# EAGLE design micromouse (EAGLE 9.0.1)
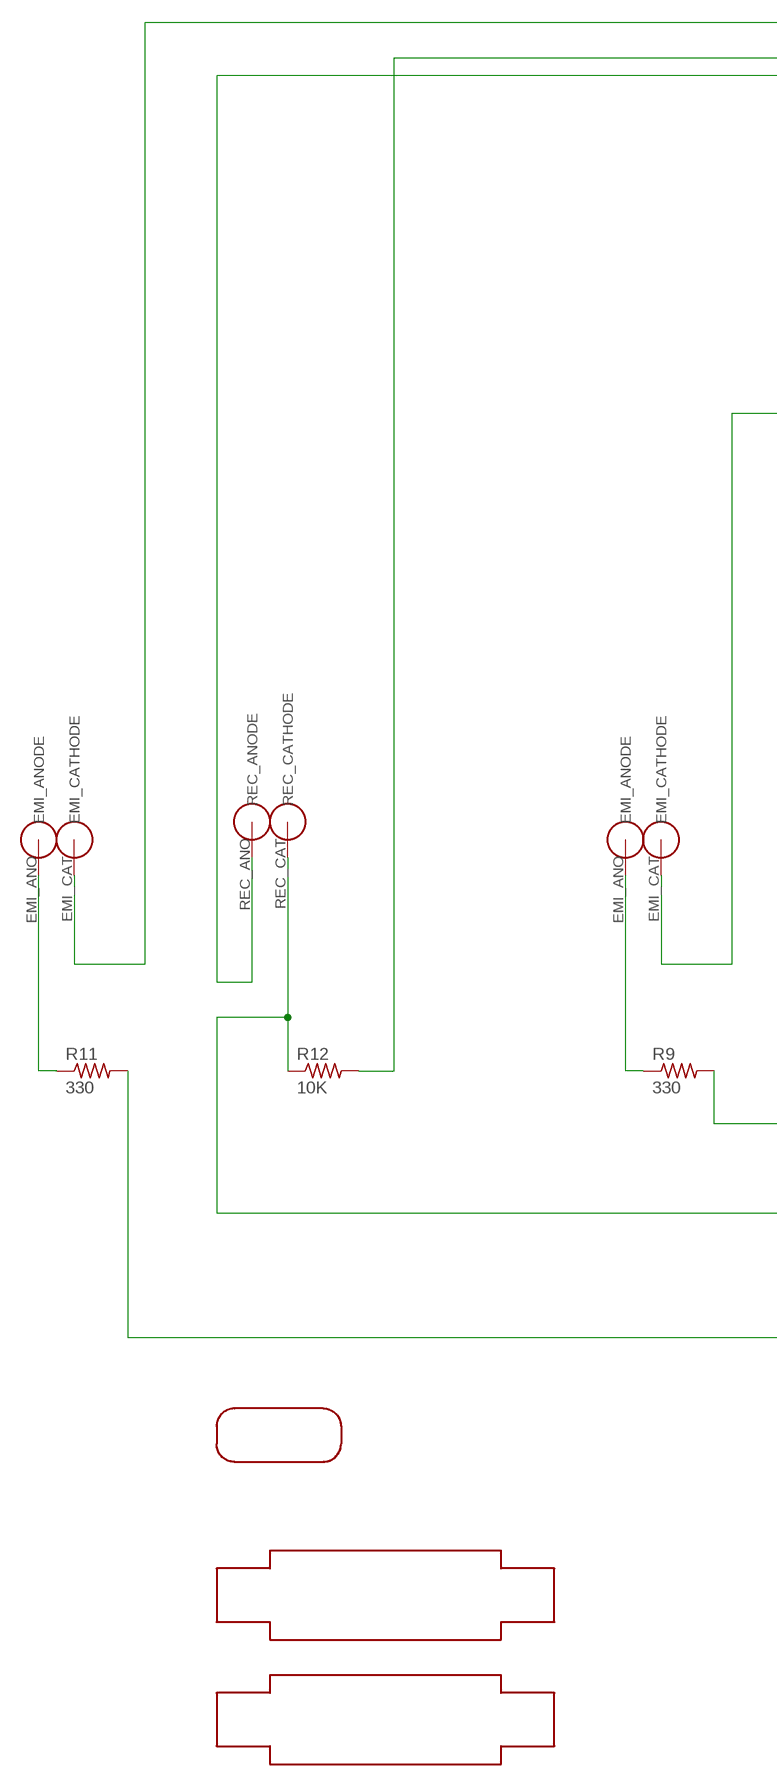
[diagram p0: schematic, sheet 1, part 1 of 2]
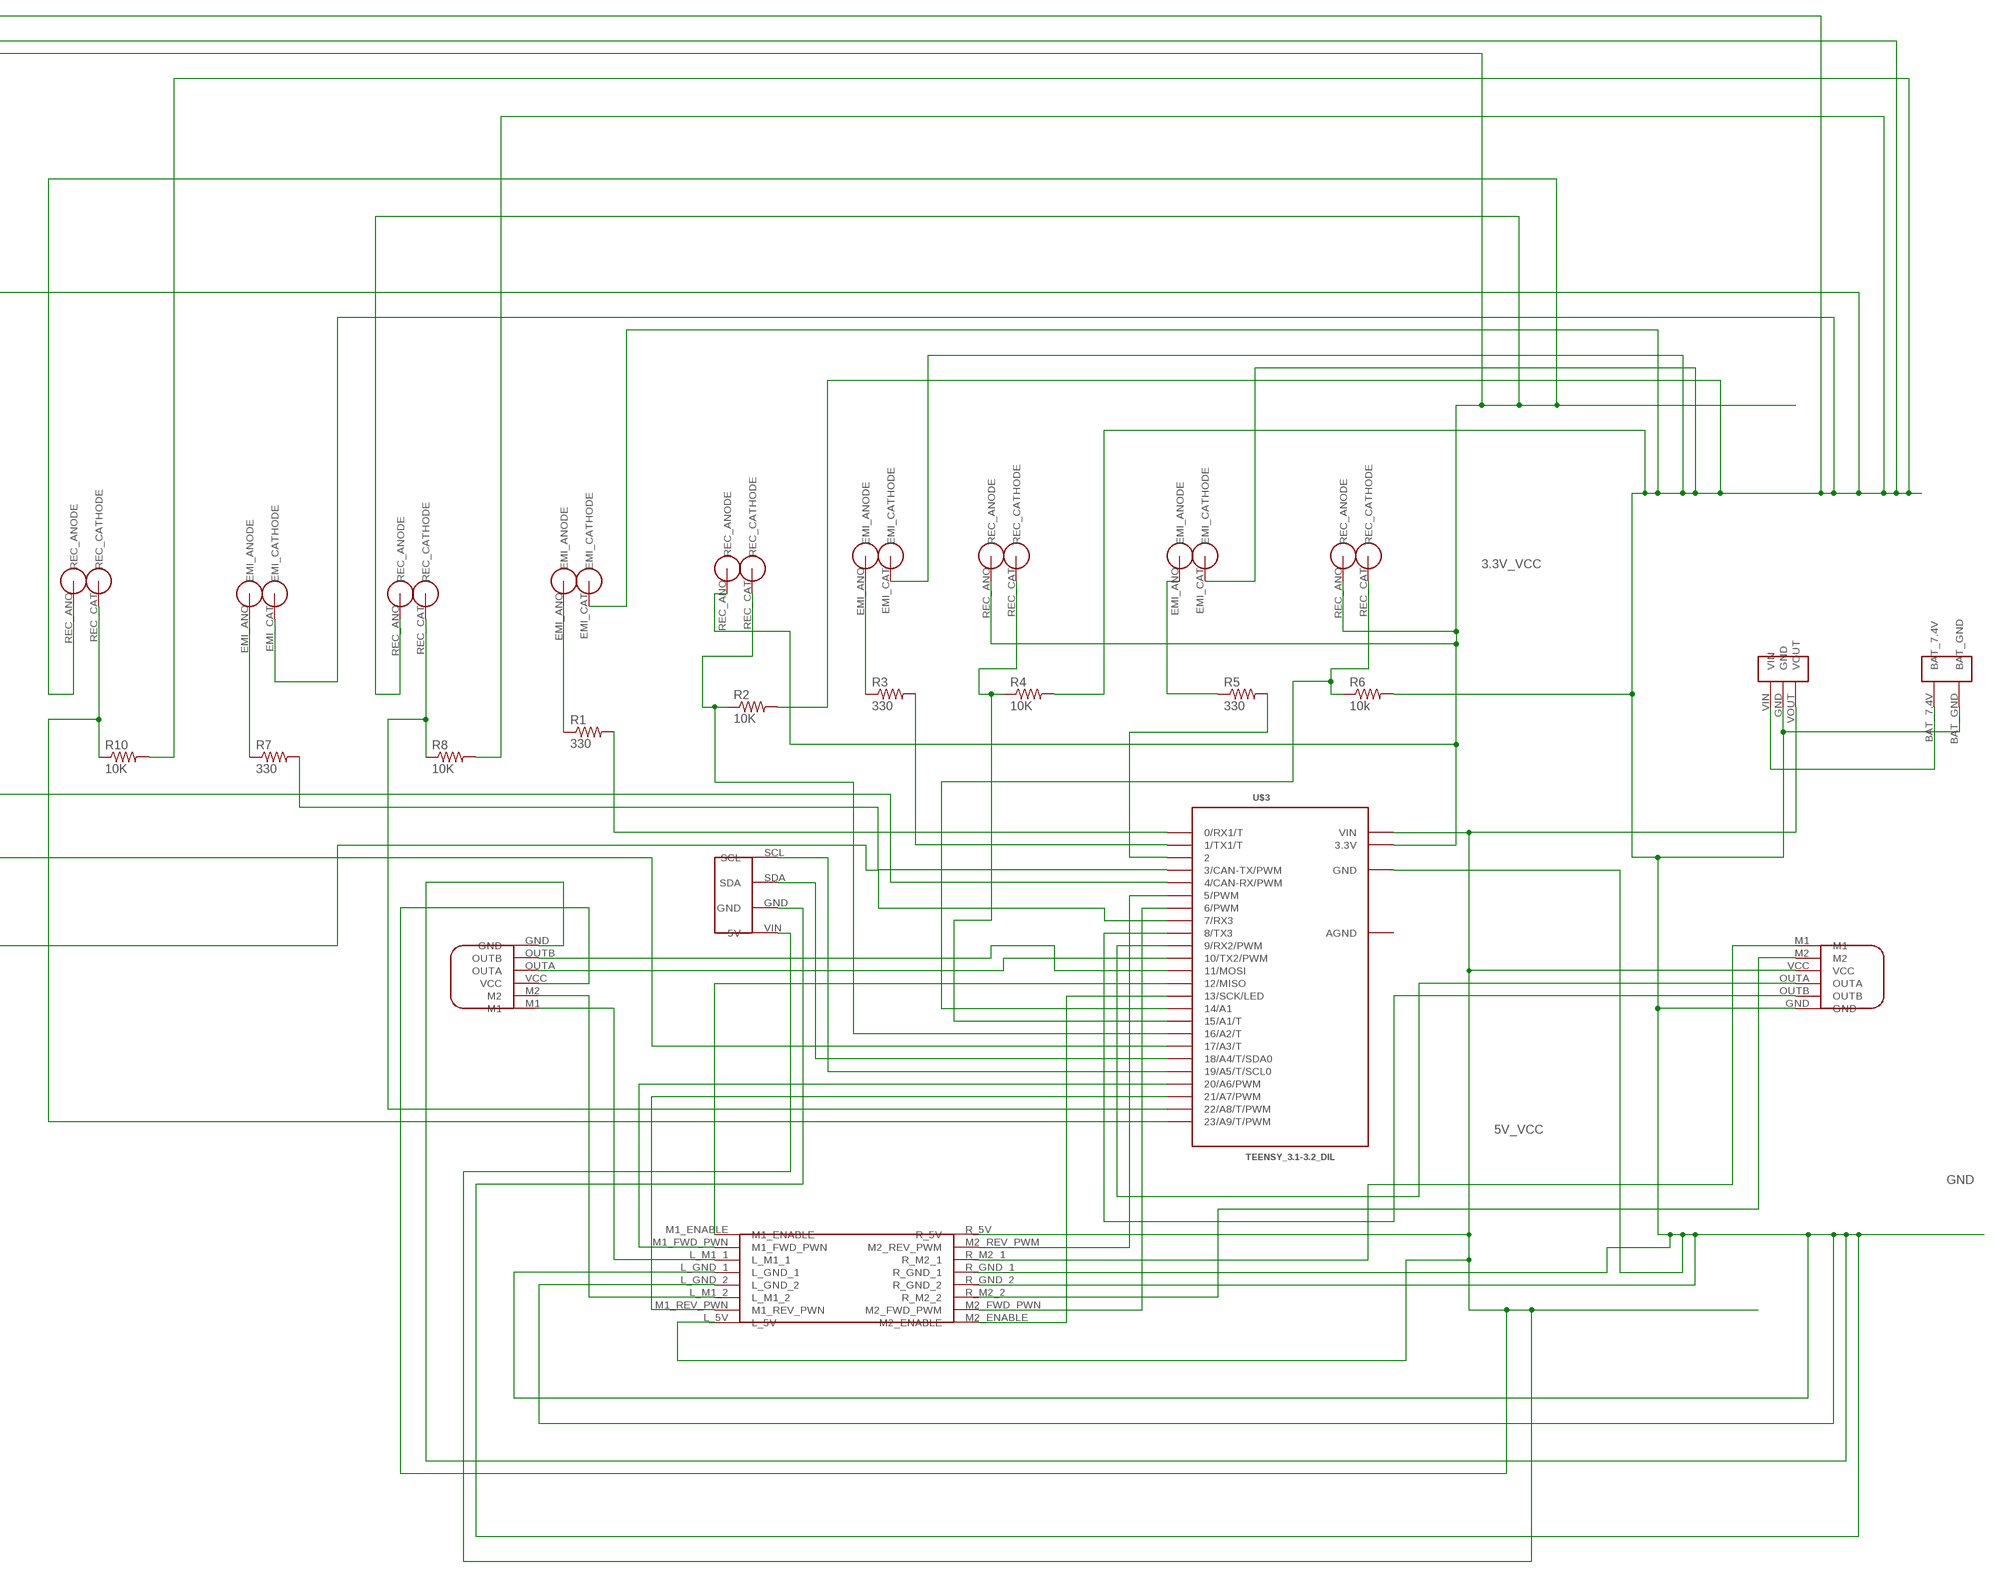
[diagram p1: schematic, sheet 1, part 2 of 2]

## Parts
R1  330  R-US_0207/10  [0207/10]
R2  10K  R-US_0207/10  [0207/10]
R3  330  R-US_0207/10  [0207/10]
R4  10K  R-US_0207/10  [0207/10]
R5  330  R-US_0207/10  [0207/10]
R6  10k  R-US_0207/10  [0207/10]
R7  330  R-US_0207/10  [0207/10]
R8  10K  R-US_0207/10  [0207/10]
R9  330  R-US_0207/10  [0207/10]
R10  10K  R-US_0207/10  [0207/10]
R11  330  R-US_0207/10  [0207/10]
R12  10K  R-US_0207/10  [0207/10]
U$1  MOTOR_ENCODER  [MOTOR_ENCODER]
U$2  MOTOR_ENCODER  [MOTOR_ENCODER]
U$3  TEENSY_3.1-3.2_DIL  [TEENSY_3.0-3.2&LC_DIL]
U$4  MOTOR_DRIVER  [MOTOR_DRIVER]
U$5  IR_RECIEVER  [IR_RECIEVER]
U$6  IR_EMITTER  [IR_EMITTER]
U$7  IR_EMITTER  [IR_EMITTER]
U$8  IR_RECIEVER  [IR_RECIEVER]
U$9  IR_EMITTER  [IR_EMITTER]
U$10  VOLTAGE_REGULATOR  [VOLTAGE_REGULATOR]
U$11  BATTERY_INPUT  [BATTERY_INPUT]
U$12  IR_RECIEVER  [IR_RECIEVER]
U$13  IMU  [IMU]
U$14  IR_EMITTER  [IR_EMITTER]
U$15  IR_RECIEVER  [IR_RECIEVER]
U$16  IR_EMITTER  [IR_EMITTER]
U$17  IR_RECIEVER  [IR_RECIEVER]
U$18  MOTOR_BRACKET  [MOTOR_BRACKET]
U$19  MOTOR_BRACKET  [MOTOR_BRACKET]
U$20  BALL_CASTER  [BALL_CASTER]
U$22  IR_EMITTER  [IR_EMITTER]
U$23  IR_RECIEVER  [IR_RECIEVER]

## Nets
3.3V_VCC: U$3.3.3V U$5.REC_ANO(REC_ANODE) U$8.REC_ANO(REC_ANODE) U$12.REC_ANO(REC_ANODE) U$15.REC_ANO(REC_ANODE) U$17.REC_ANO(REC_ANODE) U$23.REC_ANO(REC_ANODE)
5V_VCC: U$1.VCC U$2.VCC U$3.VIN U$4.L_5V U$4.R_5V U$10.VOUT U$13.VIN(5V)
GND: R2.2 R4.2 R6.2 R8.2 R10.2 R12.2 U$1.GND U$2.GND U$3.GND U$4.L_GND_1 U$4.L_GND_2 U$4.R_GND_1 U$4.R_GND_2 U$6.EMI_CAT(EMI_CATHODE) U$7.EMI_CAT(EMI_CATHODE) U$9.EMI_CAT(EMI_CATHODE) U$10.GND U$11.BAT_GND U$13.GND U$14.EMI_CAT(EMI_CATHODE) U$16.EMI_CAT(EMI_CATHODE) U$22.EMI_CAT(EMI_CATHODE)
M1_FWD_PWM: U$3.20/A6(20/A6/PWM) U$4.M1_FWD_PWN
M1_L: U$1.M1 U$4.L_M1_1
M1_R: U$2.M1 U$4.R_M2_1
M1_REV_PWM: U$3.21/A7(21/A7/PWM) U$4.M1_REV_PWN
M2_ENABLE: U$3.13(13/SCK/LED) U$4.M2_ENABLE
M2_FWD_PWM: U$3.6(6/PWM) U$4.M2_FWD_PWN(M2_FWD_PWM)
M2_L: U$1.M2 U$4.L_M1_2
M2_R: U$2.M2 U$4.R_M2_2
N$1: U$10.VIN U$11.BAT_7.4V
N$2: U$3.19/A5(19/A5/T/SCL0) U$13.SCL
N$3: U$3.18/A4(18/A4/T/SDA0) U$13.SDA
N$4: U$3.12(12/MISO) U$4.M1_ENABLE
N$5: U$3.5(5/PWM) U$4.M2_REV_PWM
N$6: R7.2 U$3.3(3/CAN-TX/PWM)
N$7: R7.1 U$14.EMI_ANO(EMI_ANODE)
N$8: R8.1 U$3.22/A8(22/A8/T/PWM) U$15.REC_CAT(REC_CATHODE)
N$9: R9.2 U$3.4(4/CAN-RX/PWM)
N$10: R9.1 U$16.EMI_ANO(EMI_ANODE)
N$11: R11.2 U$3.7(7/RX3)
N$12: R10.1 U$3.23/A9(23/A9/T/PWM) U$17.REC_CAT(REC_CATHODE)
N$13: R11.1 U$22.EMI_ANO(EMI_ANODE)
N$14: R12.1 U$3.17/A3(17/A3/T) U$23.REC_CAT(REC_CATHODE)
N$19: R1.2 U$3.0(0/RX1/T)
N$20: R1.1 U$9.EMI_ANO(EMI_ANODE)
N$21: R6.1 U$3.14/A0(14/A1) U$8.REC_CAT(REC_CATHODE)
N$22: R3.2 U$3.1(1/TX1/T)
N$23: R3.1 U$6.EMI_ANO(EMI_ANODE)
N$24: R4.1 U$3.15/A1(15/A1/T) U$12.REC_CAT(REC_CATHODE)
N$25: R5.2 U$3.2
N$26: R5.1 U$7.EMI_ANO(EMI_ANODE)
N$28: R2.1 U$3.16/A2(16/A2/T) U$5.REC_CAT(REC_CATHODE)
OUTA_L: U$1.OUTA U$3.10(10/TX2/PWM)
OUTA_R: U$2.OUTA U$3.9(9/RX2/PWM)
OUTB_L: U$1.OUTB U$3.11(11/MOSI)
OUTB_R: U$2.OUTB U$3.8(8/TX3)

## Power pins joined to a net without a drawn wire
AGND: U$3.AGND

## Library data of the parts
R1-R12 = rcl:R-US_: RESISTOR, American symbol; SPICEPREFIX: R
U$1 U$2 = MOTOR_ENCODER:MOTOR_ENCODER
U$3 = Teensy_3_and_LC_Series_Boards_v1.4:TEENSY_3.1-3.2_DIL: Teensy 3.1 or 3.2 in a DIL Layout.
U$4 = motor_driver:MOTOR_DRIVER
U$5 U$8 U$12 U$15 U$17 U$23 = IR_RECIEVER:IR_RECIEVER
U$6 U$7 U$9 U$14 U$16 U$22 = IR_EMITTER:IR_EMITTER
U$10 = VOLTAGE_REGULATOR:VOLTAGE_REGULATOR
U$11 = Battery_input:BATTERY_INPUT
U$13 = IMU:IMU
U$18 U$19 = MOTOR_BRACKET:MOTOR_BRACKET
U$20 = BALL_CASTER:BALL_CASTER

## Board
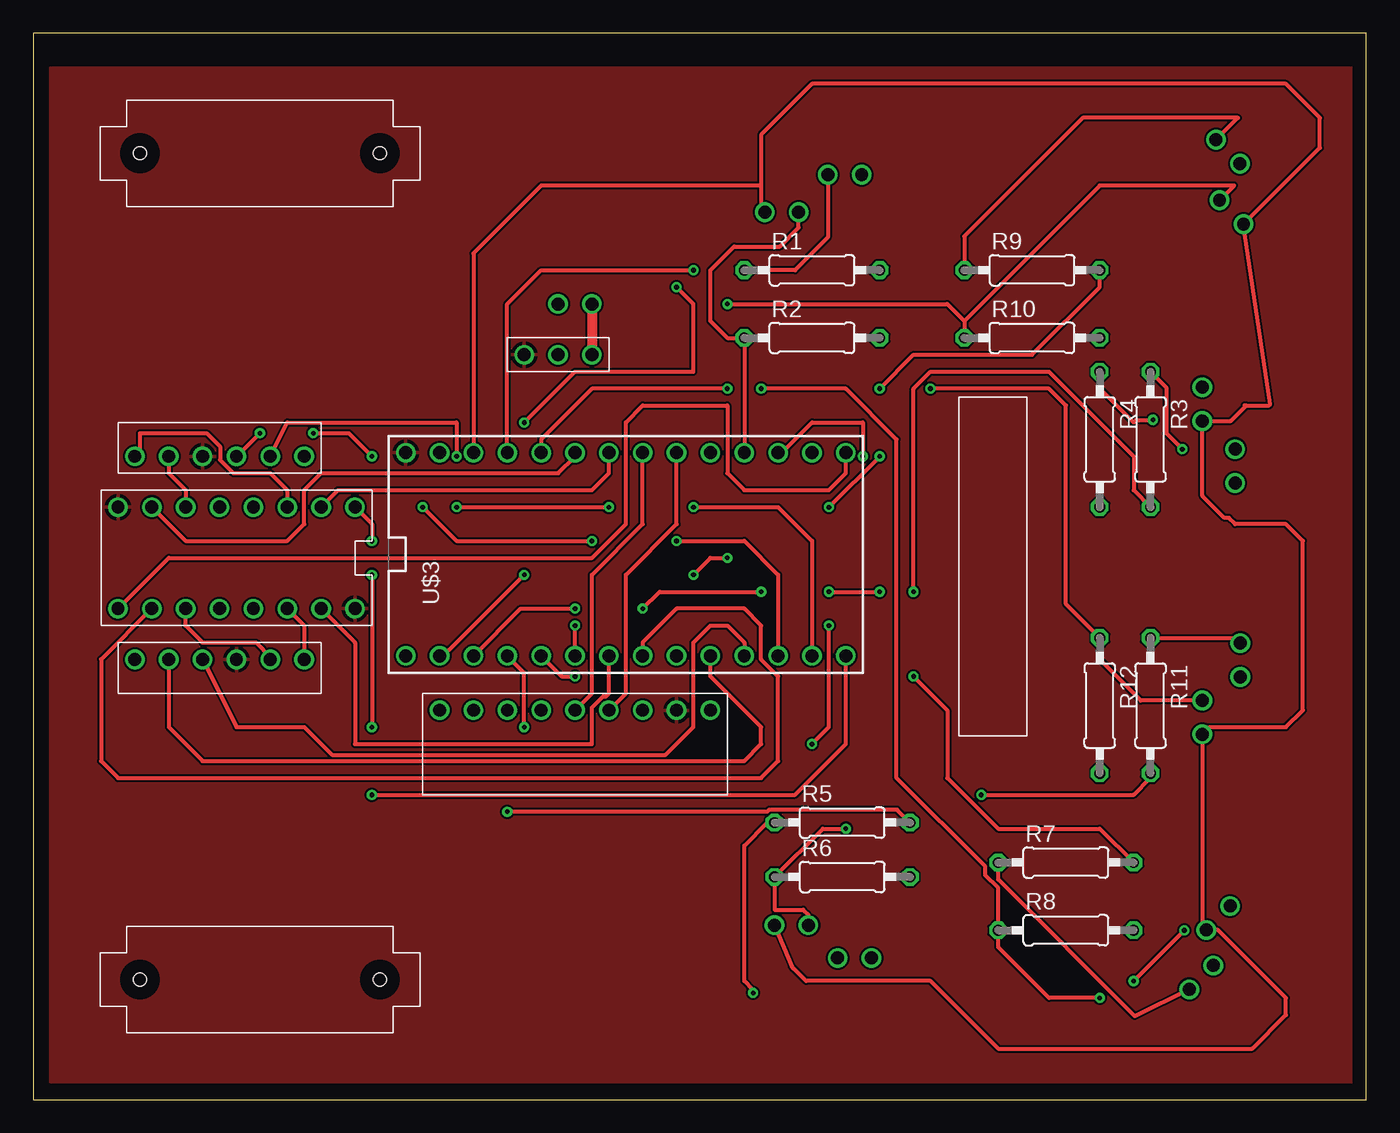
[diagram p2: board, top side]
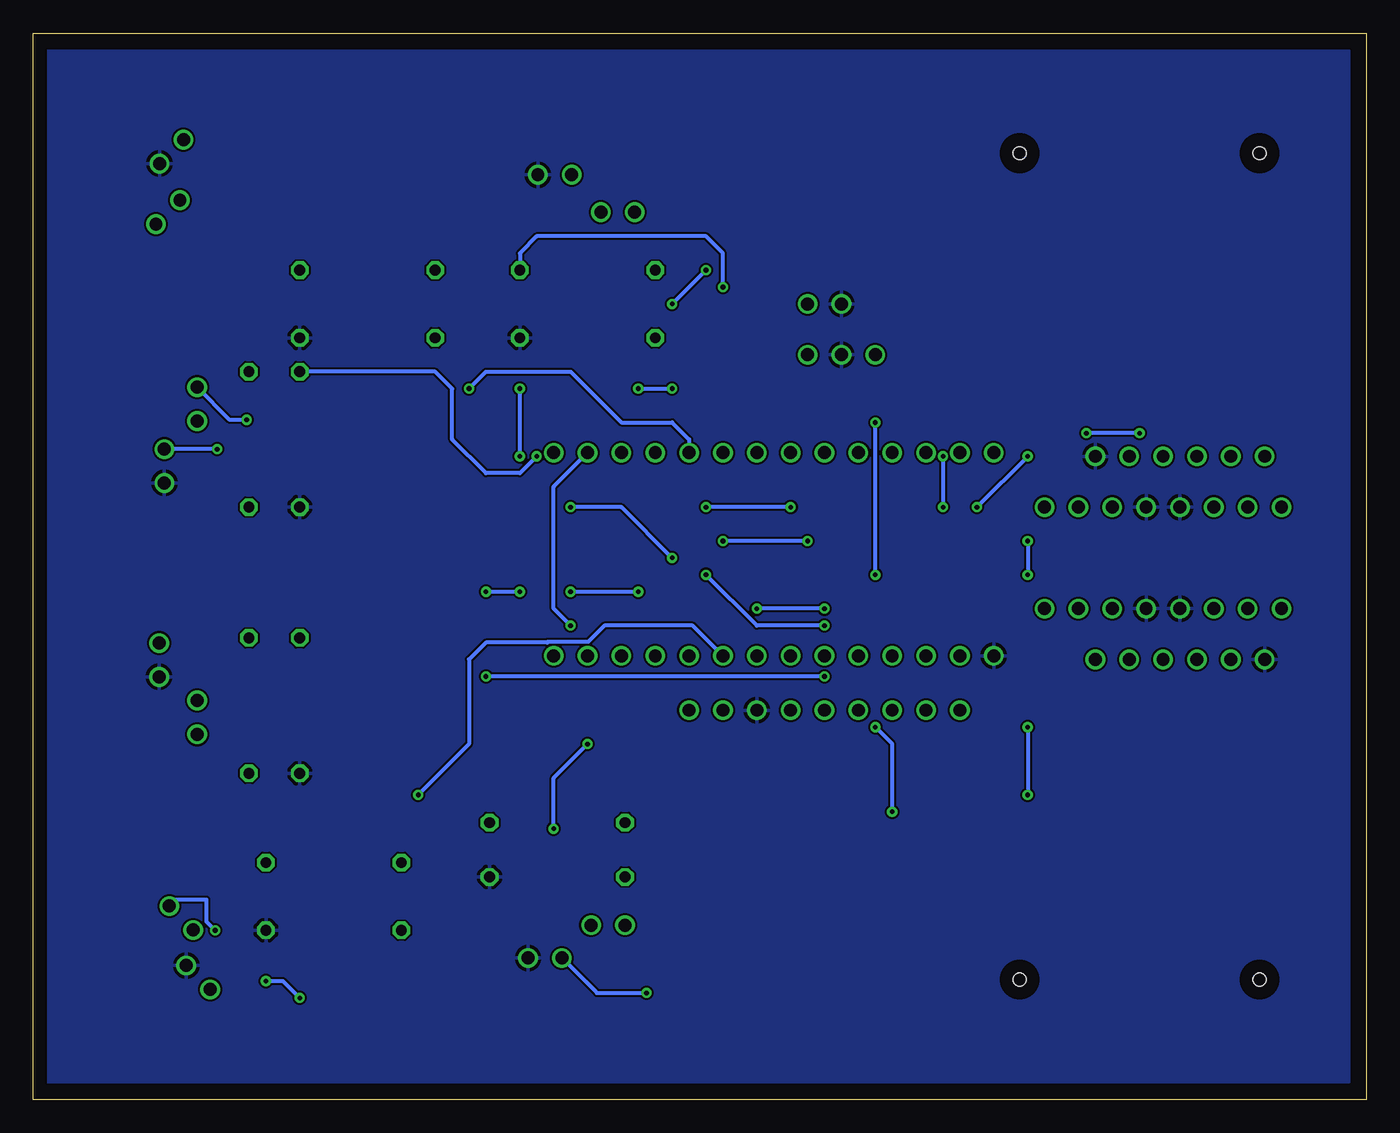
[diagram p3: board, bottom side, seen from below]

Size 100 x 80 mm. Coordinates in mm from the lower left corner, seen from the top.
Outline: 0,0 100,0 100,80 0,80 0,0
Copper layers (1*16): Top 0.035mm / dielectric 1.5mm / Bottom 0.035mm
Design rules "default": minimum track width 6mil, minimum drill 0.35mm, track to track 6mil, track to pad 6mil, pad to pad 6mil, via to via 6mil, smd to smd 6mil, copper to edge 40mil, drill to drill 6mil, minimum pad ring 10mil, minimum via ring 8mil, stop-mask expansion 4mil, vias tented up to drill 0mil, thermal gap 10mil

### Footprints (pad centres in the part's own frame; a part is rotated, then mirrored left to right if it is on the bottom)
0207/10 = drill 0.813 octagon: 1 -5.08,0; 2 5.08,0
MOTOR_ENCODER = drill 0.965: GND -1.27,3.81; M1 -1.27,-8.89; M2 -1.27,-6.35; OUTA -1.27,-1.27; OUTB -1.27,1.27; VCC -1.27,-3.81
TEENSY_3.0-3.2&LC_DIL = drill 0.965: 0 -7.62,13.97; 1 -7.62,11.43; 2 -7.62,8.89; 3 -7.62,6.35; 3.3V 7.62,11.43; 4 -7.62,3.81; 5 -7.62,1.27; 6 -7.62,-1.27; 7 -7.62,-3.81; 8 -7.62,-6.35; 9 -7.62,-8.89; 10 -7.62,-11.43; 11 -7.62,-13.97; 12 -7.62,-16.51; 13 7.62,-16.51; 14/A0 7.62,-13.97; 15/A1 7.62,-11.43; 16/A2 7.62,-8.89; 17/A3 7.62,-6.35; 18/A4 7.62,-3.81; 19/A5 7.62,-1.27; 20/A6 7.62,1.27; 21/A7 7.62,3.81; 22/A8 7.62,6.35; 23/A9 7.62,8.89; AGND 7.62,13.97; GND -7.62,16.51; VIN 7.62,16.51
MOTOR_DRIVER = drill 0.965: L_5V -3.81,-11.43; L_GND_1 -3.81,-1.27; L_GND_2 -3.81,-3.81; L_M1_1 -3.81,1.27; L_M1_2 -3.81,-6.35; M1_ENABLE -3.81,6.35; M1_FWD_PWN -3.81,3.81; M1_REV_PWN -3.81,-8.89; M2_ENABLE 3.81,-11.43; M2_FWD_PWN 3.81,-8.89; M2_REV_PWM 3.81,3.81; R_5V 3.81,6.35; R_GND_1 3.81,-1.27; R_GND_2 3.81,-3.81; R_M2_1 3.81,1.27; R_M2_2 3.81,-6.35
IR_RECIEVER = drill 0.965: REC_ANO -1.27,0; REC_CAT 1.27,0
IR_EMITTER = drill 0.965: EMI_ANO -1.27,0; EMI_CAT 1.27,0
VOLTAGE_REGULATOR = drill 0.965: GND 0,0; VIN 2.54,0; VOUT -2.54,0
BATTERY_INPUT = drill 0.965: BAT_7.4V -1.27,0; BAT_GND 1.27,0
IMU = drill 0.965: GND -1.27,0; NO_USE_1 -1.27,5.08; NO_USE_2 -1.27,-7.62; NO_USE_3 -1.27,-10.16; NO_USE_4 -1.27,-12.7; NO_USE_5 -1.27,-15.24; SCL -1.27,-5.08; SDA -1.27,-2.54; VIN -1.27,2.54
MOTOR_BRACKET = hole 0.965: -9,0; 9,0

### Placement (x,y rotation side)
R1  58.42,62.23 0 top
R2  58.42,57.15 0 top
R3  83.82,49.53 270 top
R4  80.01,49.53 270 top
R5  60.69,20.78 0 top
R6  60.69,16.7 0 top
R7  77.47,17.78 0 top
R8  77.47,12.7 0 top
R9  74.93,62.23 0 top
R10  74.93,57.15 0 top
R11  83.82,29.56 270 top
R12  80.01,29.56 270 top
U$1  16.51,46.99 270 top
U$2  11.43,34.29 90 top
U$3  44.45,40.91 90 top
U$4  17.78,40.64 270 top
U$5  56.15,66.58 0 top
U$6  90.17,47.53 270 top
U$7  61.61,10.62 0 top
U$8  56.88,13.08 0 top
U$9  60.88,69.39 0 top
U$10  39.37,55.88 0 top
U$11  40.64,59.69 180 top
U$12  87.71,52.18 90 top
U$13  45.72,27.94 270 top
U$14  87.63,9.16 45 top
U$15  88.9,13.62 45 top
U$16  89.63,71.12 315 top
U$17  89.9,66.58 135 top
U$18  17,9 0 top
U$19  17,71 0 top
U$20  72,40 270 top
U$22  90.56,32.98 270 top
U$23  87.71,28.67 90 top

### Tracks (layer width: path | path; a pad name or v marks a point on that pad's centre or on a via)
3.3V_VCC
  Top 0.305: 90.87,52.07 91,52.07 | 91,52.07 92.71,52.07 92.8,52.16 U$17.REC_ANO 96.52,71.4 96.52,73.66 93.98,76.2 58.42,76.2 54.61,72.39 54.61,68.58 | 54.61,68.58 38.1,68.58 33.02,63.5 U$3.3.3V | U$8.REC_ANO 56.91,9.96 56.93,9.93 57.03,9.84 57.98,8.89 67.31,8.89 72.39,3.81 91.44,3.81 93.98,6.35 93.98,7.62 88.88,12.72 U$15.REC_ANO 87.71,13.01 U$23.REC_ANO 88.25,27.94 93.98,27.94 95.25,29.21 95.25,41.91 93.98,43.18 90.17,43.18 89.71,43.64 89.36,43.64 87.71,45.29 U$12.REC_ANO 89.84,50.91 91,52.07 | 54.61,68.58 54.61,66.85 U$5.REC_ANO
5V_VCC
  Top 0.305: 27.67,48.53 U$3.VIN
  pour Top: 1.27,1.27 1.27,77.47 99.06,77.47 99.06,1.27
GND
  pour Bottom: 99.06,1.27 99.06,78.74 1.27,78.74 1.27,1.27
M1_FWD_PWM
  Top 0.305: U$4.M1_FWD_PWN 22.86,45.72 41.91,45.72 43.18,46.99 U$3.20/A6
M1_L
  Top 0.305: U$4.L_M1_1 19.05,45.72 17.78,46.99 15.01,46.99 14,48 14,49 13,50 8,50 8,48.64 U$1.M1
M1_R
  Top 0.305: U$4.R_M2_1 20.32,35.56 U$2.M1
M1_REV_PWM
  Top 0.305: U$4.M1_REV_PWN 11.43,41.91 19.05,41.91 20.32,43.18 20.32,45.72 21.59,46.99 39.37,46.99 40.64,48.26 U$3.21/A7
M2_ENABLE
  Top 0.305: U$4.M2_ENABLE 10.16,40.64 41.91,40.64 44.45,43.18 44.45,50.8 45.72,52.07 52.07,52.07 52.07,46.99 53.34,45.72 59.69,45.72 60.96,46.99 U$3.13
M2_FWD_PWM
  Top 0.305: U$4.M2_FWD_PWN 5.08,33.02 5.08,25.4 6.35,24.13 54.61,24.13 55.88,25.4 55.88,31.75 54.61,33.02 54.61,35.56 53.34,36.83 48.26,36.83 45.72,34.29 U$3.6
M2_L
  Top 0.305: U$1.M2 10.16,46.99 11.43,45.72 U$4.L_M1_2
M2_R
  Top 0.305: U$4.R_M2_2 11.43,35.56 12.7,34.29 16.71,34.29 17.78,33.22 U$2.M2
N$1
  Top 0.762: U$11.BAT_7.4V U$10.VIN
N$2
  Top 0.305: U$13.SCL 41.91,30.48 41.91,39.37 45.72,43.18 U$3.19/A5
N$3
  Top 0.305: U$13.SDA 44.45,30.48 44.45,39.37 48.26,43.18 U$3.18/A4
N$4  (via drill 0.35)
  Top 0.305: U$4.M1_ENABLE 25.4,43.18 v25.4,41.91 | v25.4,39.37 v25.4,27.94 | v25.4,22.86 57.15,22.86 60.96,26.67 U$3.12
  Bottom 0.305: v25.4,41.91 v25.4,39.37 | v25.4,27.94 v25.4,22.86
N$5
  Top 0.305: U$4.M2_REV_PWM 24.13,34.29 24.13,26.67 41.91,26.67 41.91,29.41 42.75,30.25 42.95,30.25 43.18,30.48 U$3.5
N$6  (via drill 0.35)
  Top 0.305: U$3.3 39.64,31.75 v40.64,31.75 | v66.04,31.75 68.58,29.21 68.58,24.13 72.39,20.32 80.01,20.32 R7.2
  Bottom 0.305: v40.64,31.75 v66.04,31.75
N$7
  Top 0.305: U$14.EMI_ANO 82.64,6.26 72.39,16.51 R7.1
N$8  (via drill 0.35)
  Top 0.305: v80.01,7.62 76.2,7.62 72.39,11.43 R8.1 72.39,15.86 71.42,16.83 71.42,17.48 64.77,24.13 64.77,49.53 60.96,53.34 v54.61,53.34 | v52.07,53.34 41.91,53.34 38.1,49.53 U$3.22/A8 | v82.55,8.89 v86.36,12.7
  Bottom 0.305: v82.55,8.89 81.28,8.89 v80.01,7.62 | v54.61,53.34 v52.07,53.34 | v86.36,12.7 87,13.34 87,15 89.32,15 U$15.REC_CAT
N$9  (via drill 0.35)
  Top 0.305: U$3.4 v40.64,35.56 | v49.53,39.37 50.8,40.64 v52.07,40.64 | v59.69,44.45 v63.5,48.26 | v63.5,53.34 66.04,55.88 74.93,55.88 80.01,60.96 R9.2
  Bottom 0.305: v40.64,35.56 45.72,35.56 v49.53,39.37 | v52.07,40.64 55.88,44.45 v59.69,44.45 | v63.5,48.26 v63.5,53.34
N$10
  Top 0.305: U$16.EMI_ANO 90.37,73.66 78.74,73.66 69.85,64.77 R9.1
N$11  (via drill 0.35)
  Top 0.305: R11.2 83.82,24.13 82.55,22.86 v71.12,22.86
  Bottom 0.305: U$3.7 50.53,35.56 57.15,35.56 58.38,34.33 61.39,34.33 61.43,34.29 66.04,34.29 67.31,33.02 67.31,26.67 v71.12,22.86
N$12  (via drill 0.35)
  Top 0.305: U$17.REC_CAT 90.1,68.58 80.01,68.58 69.85,58.42 | 69.85,58.42 R10.1 | U$3.23/A9 35.56,59.69 38.1,62.23 v49.53,62.23 | v52.07,59.69 68.58,59.69 69.85,58.42
  Bottom 0.305: v49.53,62.23 v52.07,59.69
N$13
  Top 0.305: R11.1 90.17,34.64 U$22.EMI_ANO
N$14  (via drill 0.35)
  Top 0.305: U$23.REC_CAT 83.09,29.94 80.01,33.02 R12.1 77.47,37.18 77.47,52.07 76.2,53.34 v67.31,53.34
  Bottom 0.305: v67.31,53.34 66.04,54.61 59.69,54.61 55.88,50.8 52.07,50.8 50.8,49.53 U$3.17/A3
N$19  (via drill 0.35)
  Top 0.305: U$3.0 30.75,33.29 v36.83,39.37 | v36.83,50.8 40.64,54.61 49.53,54.61 49.53,59.69 v48.26,60.96
  Bottom 0.305: v36.83,39.37 v36.83,50.8 | v48.26,60.96 48.26,63.5 49.53,64.77 62.23,64.77 63.5,63.5 R1.2
N$20
  Top 0.305: U$9.EMI_ANO 59.61,64.69 57.15,62.23 R1.1
N$21  (via drill 0.35)
  Top 0.305: v60.96,20.32 59.23,20.32 R6.1 55.61,14.24 57.76,14.24 58.15,13.85 U$8.REC_CAT | v58.42,26.67 59.69,27.94 v59.69,35.56
  Bottom 0.305: v60.96,20.32 60.96,24.13 v58.42,26.67 | v59.69,35.56 60.96,36.83 60.96,45.99 U$3.14/A0
N$22  (via drill 0.35)
  Top 0.305: U$3.1 36.56,36.83 v40.64,36.83 | v45.72,36.83 46.99,38.1 v54.61,38.1 | v59.69,38.1 v63.5,38.1 | v66.04,38.1 66.04,53.34 67.31,54.61 76.2,54.61 82.55,48.26 82.55,45.72 R3.2
  Bottom 0.305: v40.64,36.83 v45.72,36.83 | v54.61,38.1 v59.69,38.1 | v63.5,38.1 v66.04,38.1
N$23  (via drill 0.35)
  Top 0.305: R3.1 85,53.43 85,50 v86.2,48.8
  Bottom 0.305: v86.2,48.8 U$6.EMI_ANO
N$24  (via drill 0.35)
  Top 0.305: R4.1 80.01,53.34 82.55,50.8 82.75,51 v84,51 | U$3.15/A1 56.15,48.53 58.42,50.8 62.23,50.8 v62.23,48.26
  Bottom 0.305: v62.23,48.26 63.5,46.99 66.04,46.99 68.58,49.53 68.58,53.34 69.85,54.61 R4.1 | v84,51 85.26,51 U$12.REC_CAT
N$25  (via drill 0.35)
  Top 0.305: v35.56,21.59 55.05,21.59 55.21,21.75 64.81,21.75 R5.2 | U$3.2 36.83,32.02 v36.83,27.94
  Bottom 0.305: v35.56,21.59 35.56,26.67 v36.83,27.94
N$26  (via drill 0.35)
  Top 0.305: R5.1 55.07,20.78 53.34,19.05 53.34,8.89 54,8.23 v54,8
  Bottom 0.305: U$7.EMI_ANO 57.72,8 v54,8
N$28
  Top 0.305: U$3.16/A2 R2.1 52.07,57.15 50.8,58.42 50.8,62.23 52.57,64 56,64 57.42,65.42 U$5.REC_CAT
OUTA_L  (via drill 0.35)
  Top 0.305: v29.21,44.45 31.75,41.91 v41.91,41.91 | v48.26,41.91 53.34,41.91 55.88,39.37 U$3.10 | U$1.OUTA 15.26,48.26 v17,50 | v21,50 23.66,50 v25.4,48.26
  Bottom 0.305: v25.4,48.26 v29.21,44.45 | v41.91,41.91 v48.26,41.91 | v17,50 v21,50
OUTA_R
  Top 0.305: U$2.OUTA 15.24,27.94 20.32,27.94 22.4,25.86 47.45,25.86 49.53,27.94 49.53,34.29 50.8,35.56 52.07,35.56 53.34,34.29 U$3.9
OUTB_L  (via drill 0.35)
  Top 0.305: U$1.OUTB 19.05,50.8 31.75,50.8 v31.75,48.26 | v31.75,44.45 v43.18,44.45 | v49.53,44.45 55.88,44.45 58.42,41.91 U$3.11
  Bottom 0.305: v31.75,48.26 v31.75,44.45 | v43.18,44.45 v49.53,44.45
OUTB_R
  Top 0.305: U$2.OUTB 10.16,27.94 12.7,25.4 53.34,25.4 54.61,26.67 54.61,27.94 50.8,31.75 U$3.8